# Altium project NeptuneSenseOutdoor.PrjPcb
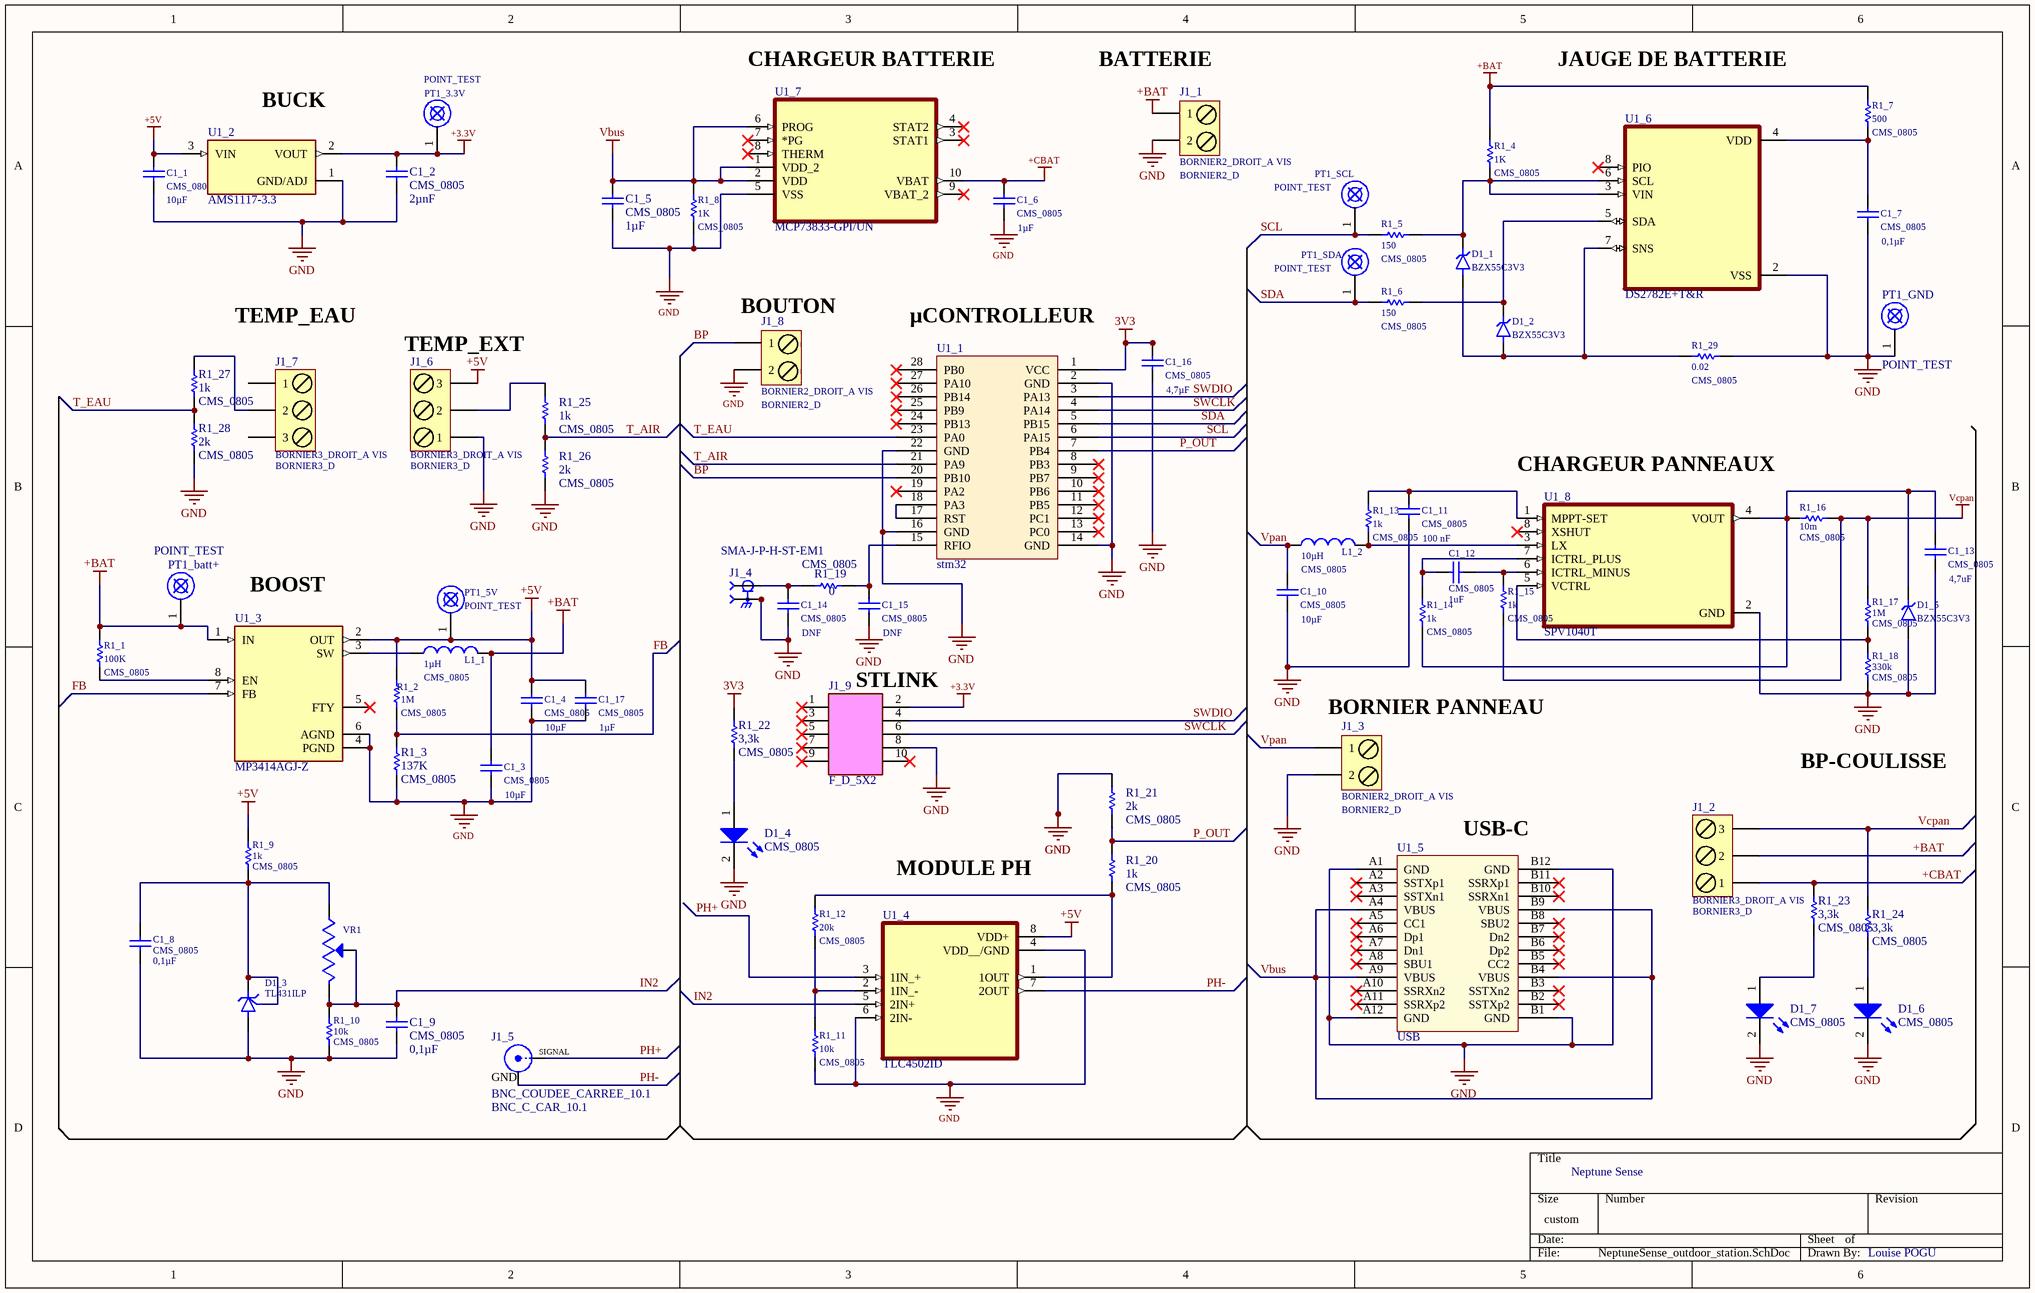
[diagram p0: NeptuneSense_outdoor_station.SchDoc]
1 sheet, 79 parts. Net scope: global (net labels, ports and power ports of the same name join across sheets).
Board file: NeptuneSense_outdoor_station.PcbDoc

## Sheet NeptuneSense_outdoor_station.SchDoc
size 381 x 241 mm; SheetNumber: 1; SheetTotal: 1

### Parts
C1_1  value 10µF  [CONDENSATEUR_CMS_0805]  (hidden comment: CMS_0805)
C1_2  value 2µnF  [CONDENSATEUR_CMS_0805]  (hidden comment: CMS_0805)
C1_3  value 10µF  [CONDENSATEUR_CMS_0805]  (hidden comment: CMS_0805)
C1_4  value 10µF  [CONDENSATEUR_CMS_0805]  (hidden comment: CMS_0805)
C1_5  value 1µF  [CONDENSATEUR_CMS_0805]  (hidden comment: CMS_0805)
C1_6  value 1µF  [CONDENSATEUR_CMS_0805]  (hidden comment: CMS_0805)
C1_7  value 0,1µF  [CONDENSATEUR_CMS_0805]  (hidden comment: CMS_0805)
C1_8  value 0,1µF  [CONDENSATEUR_CMS_0805]  (hidden comment: CMS_0805)
C1_9  value 0,1µF  [CONDENSATEUR_CMS_0805]  (hidden comment: CMS_0805)
C1_10  value 10µF  [CONDENSATEUR_CMS_0805]  (hidden comment: CMS_0805)
C1_11  value 100 nF  [CONDENSATEUR_CMS_0805]  (hidden comment: CMS_0805)
C1_12  value 1uF  [CONDENSATEUR_CMS_0805]  (hidden comment: CMS_0805)
C1_13  value 4,7uF  [CONDENSATEUR_CMS_0805]  (hidden comment: CMS_0805)
C1_14  value DNF  [CONDENSATEUR_CMS_0805]  (hidden comment: CMS_0805)  (net tie, no BOM)
C1_15  value DNF  [CONDENSATEUR_CMS_0805]  (hidden comment: CMS_0805)
C1_16  value 4,7µF  [CONDENSATEUR_CMS_0805]  (hidden comment: CMS_0805)
C1_17  value 1µF  [CONDENSATEUR_CMS_0805]  (hidden comment: CMS_0805)
D1_1  BZX55C3V3  [DIOAD928W47L399D179]
D1_2  BZX55C3V3  [DIOAD928W47L399D179]
D1_3  TL431ILP  [TO92127P520H660-3]
D1_4  Type: CMS_0805  [LED_CMS_0805]  (hidden comment: LED_CMS_0805)
D1_5  BZX55C3V3  [DIOAD928W47L399D179]
D1_6  Type: CMS_0805  [LED_CMS_0805]  (hidden comment: LED_CMS_0805)
D1_7  Type: CMS_0805  [LED_CMS_0805]  (hidden comment: LED_CMS_0805)
J1_1  BORNIER2_DROIT_A VIS  Type: BORNIER2_D  [BORNIER2_A_VIS]
J1_2  BORNIER3_DROIT_A VIS  Type: BORNIER3_D  [BORNIER3_A_VIS]
J1_3  BORNIER2_DROIT_A VIS  Type: BORNIER2_D  [BORNIER2_A_VIS]
J1_4  SMA-J-P-H-ST-EM1  [SAMTEC_SMA-J-P-H-ST-EM1]
J1_5  BNC_COUDEE_CARREE_10.1  [BNC_C_CAR_10.1]
J1_6  BORNIER3_DROIT_A VIS  Type: BORNIER3_D  [BORNIER3_A_VIS]
J1_7  BORNIER3_DROIT_A VIS  Type: BORNIER3_D  [BORNIER3_A_VIS]
J1_8  BORNIER2_DROIT_A VIS  Type: BORNIER2_D  [BORNIER2_A_VIS]
J1_9  Type: F_D_5X2  [BARRETTE_5X2_F_D]  (hidden comment: BARRETTE_5 CONTACTS_2 RANGEES_FEMELLE_DROITE)
L1_1  value 1µH  Type: CMS_0805  [INDUCTANCE_CMS_0805]  (hidden comment: INDUCTANCE_CMS_0805)
L1_2  value 10µH  Type: CMS_0805  [INDUCTANCE_CMS_0805]  (hidden comment: INDUCTANCE_CMS_0805)
PT1_3.3V  POINT_TEST  [POINT_TEST]
PT1_5V  POINT_TEST  [POINT_TEST]
PT1_batt+  POINT_TEST  [POINT_TEST]
PT1_GND  POINT_TEST  [POINT_TEST]
PT1_SCL  POINT_TEST  [POINT_TEST]
PT1_SDA  POINT_TEST  [POINT_TEST]
R1_1  value 100K  Type: CMS_0805  [RESISTANCE_CMS_0805]  (hidden comment: RESISTANCE_CMS_0805)
R1_2  value 1M  Type: CMS_0805  [RESISTANCE_CMS_0805]  (hidden comment: RESISTANCE_CMS_0805)
R1_3  value 137K  Type: CMS_0805  [RESISTANCE_CMS_0805]  (hidden comment: RESISTANCE_CMS_0805)
R1_4  value 1K  Type: CMS_0805  [RESISTANCE_CMS_0805]  (hidden comment: RESISTANCE_CMS_0805)
R1_5  value 150  Type: CMS_0805  [RESISTANCE_CMS_0805]  (hidden comment: RESISTANCE_CMS_0805)
R1_6  value 150  Type: CMS_0805  [RESISTANCE_CMS_0805]  (hidden comment: RESISTANCE_CMS_0805)
R1_7  value 500  Type: CMS_0805  [RESISTANCE_CMS_0805]  (hidden comment: RESISTANCE_CMS_0805)
R1_8  value 1K  Type: CMS_0805  [RESISTANCE_CMS_0805]  (hidden comment: RESISTANCE_CMS_0805)
R1_9  value 1k  Type: CMS_0805  [RESISTANCE_CMS_0805]  (hidden comment: RESISTANCE_CMS_0805)
R1_10  value 10k  Type: CMS_0805  [RESISTANCE_CMS_0805]  (hidden comment: RESISTANCE_CMS_0805)
R1_11  value 10k  Type: CMS_0805  [RESISTANCE_CMS_0805]  (hidden comment: RESISTANCE_CMS_0805)
R1_12  value 20k  Type: CMS_0805  [RESISTANCE_CMS_0805]  (hidden comment: RESISTANCE_CMS_0805)
R1_13  value 1k  Type: CMS_0805  [RESISTANCE_CMS_0805]  (hidden comment: RESISTANCE_CMS_0805)
R1_14  value 1k  Type: CMS_0805  [RESISTANCE_CMS_0805]  (hidden comment: RESISTANCE_CMS_0805)
R1_15  value 1k  Type: CMS_0805  [RESISTANCE_CMS_0805]  (hidden comment: RESISTANCE_CMS_0805)
R1_16  value 10m  Type: CMS_0805  [RESISTANCE_CMS_0805]  (hidden comment: RESISTANCE_CMS_0805)
R1_17  value 1M  Type: CMS_0805  [RESISTANCE_CMS_0805]  (hidden comment: RESISTANCE_CMS_0805)
R1_18  value 330k  Type: CMS_0805  [RESISTANCE_CMS_0805]  (hidden comment: RESISTANCE_CMS_0805)
R1_19  value 0  Type: CMS_0805  [RESISTANCE_CMS_0805]  (hidden comment: RESISTANCE_CMS_0805)
R1_20  value 1k  Type: CMS_0805  [RESISTANCE_CMS_0805]  (hidden comment: RESISTANCE_CMS_0805)
R1_21  value 2k  Type: CMS_0805  [RESISTANCE_CMS_0805]  (hidden comment: RESISTANCE_CMS_0805)
R1_22  value 3,3k  Type: CMS_0805  [RESISTANCE_CMS_0805]  (hidden comment: RESISTANCE_CMS_0805)
R1_23  value 3,3k  Type: CMS_0805  [RESISTANCE_CMS_0805]  (hidden comment: RESISTANCE_CMS_0805)
R1_24  value 3,3k  Type: CMS_0805  [RESISTANCE_CMS_0805]  (hidden comment: RESISTANCE_CMS_0805)
R1_25  value 1k  Type: CMS_0805  [RESISTANCE_CMS_0805]  (hidden comment: RESISTANCE_CMS_0805)
R1_26  value 2k  Type: CMS_0805  [RESISTANCE_CMS_0805]  (hidden comment: RESISTANCE_CMS_0805)
R1_27  value 1k  Type: CMS_0805  [RESISTANCE_CMS_0805]  (hidden comment: RESISTANCE_CMS_0805)
R1_28  value 2k  Type: CMS_0805  [RESISTANCE_CMS_0805]  (hidden comment: RESISTANCE_CMS_0805)
R1_29  value 0.02  Type: CMS_0805  [RESISTANCE_CMS_0805]  (hidden comment: RESISTANCE_CMS_0805)
U1_1  stm32  [QFN127P600-8N]
U1_2  AMS1117-3.3  [SOT229P700X180-4N]
U1_3  MP3414AGJ-Z  [SOT65P280X100-8N]
U1_4  TLC4502ID  [SOIC127P599X175-8N]
U1_5  USB  [USB]
U1_6  DS2782E+T&R  [SOP65P640X110-8N]
U1_7  MCP73833-GPI/UN  [SOP50P490X110-10N]
U1_8  SPV1040T  [SOP65P640X120-8N]
VR1  3296W1103LF  [TRIM_3296W1103LF]  (value not drawn)

### Nets
3V3: C1_16.2 R1_22.1 U1_1.1(VCC)
+3.3V: C1_2.2 J1_9.2 PT1_3.3V.1 U1_2.2(VOUT)
+5V: C1_1.1 C1_4.2 C1_17.2 J1_6.3 PT1_5V.1 R1_2.2 R1_9.1 U1_2.3(VIN) U1_3.2(OUT) U1_4.8(VDD+)
+BAT: C1_3.2 J1_1.1 J1_2.2 L1_1.2 PT1_batt+.1 R1_1.2 R1_4.2 R1_7.2 U1_3.1(IN)
+CBAT: C1_6.2 J1_2.1 R1_23.1 U1_7.10(VBAT)
GND: C1_1.2 C1_2.1 C1_3.1 C1_4.1 C1_5.1 C1_6.1 C1_7.1 C1_8.1 C1_9.1 C1_10.1 C1_11.1 C1_13.1 C1_14.1 C1_15.1 C1_16.1 C1_17.1 D1_3.2(A) D1_4.2 D1_5.A D1_6.2 D1_7.2 J1_1.2 J1_3.2 J1_4.2_1 J1_4.2_2 J1_4.3_1 J1_4.3_2 J1_6.1 J1_8.2 J1_9.8 PT1_GND.1 R1_3.1 R1_8.1 R1_10.2 R1_11.2 R1_18.1 R1_21.1 R1_26.2 R1_28.2 R1_29.1 U1_1.2(GND) U1_1.14(GND) U1_1.16(GND) U1_1.22(GND) U1_2.1(GND/ADJ) U1_3.4(PGND) U1_3.6(AGND) U1_4.4(VDD__/GND) U1_4.6(2IN-) U1_5.A1(GND) U1_5.A12(GND) U1_5.B1(GND) U1_5.B12(GND) U1_6.2(VSS) U1_7.5(VSS) U1_8.2(GND)
Vbus: C1_5.2 R1_8.2 U1_5.A4(VBUS) U1_5.A9(VBUS) U1_5.B4(VBUS) U1_5.B9(VBUS) U1_7.1(VDD_2) U1_7.2(VDD) U1_7.6(PROG)
Vcpan: J1_2.3 R1_15.2 R1_16.2 R1_17.2 R1_24.1
BP: J1_8.1 U1_1.20(PB10)
FB: R1_2.1 R1_3.2 U1_3.7(FB)
IN2: C1_9.2 R1_10.1 U1_4.5(2IN+) VR1.2(WIPER) VR1.3(CW)
P_OUT: R1_20.1 R1_21.2 U1_1.7(PB4)
PH+: J1_5.1(X) U1_4.3(1IN_+)
PH-: J1_5.2(Y) U1_4.7(2OUT)
SCL: PT1_SCL.1 R1_5.2 U1_1.6(PA15)
SDA: PT1_SDA.1 R1_6.2 U1_1.5(PB15)
SWCLK: J1_9.6 U1_1.4(PA14)
SWDIO: J1_9.4 U1_1.3(PA13)
T_AIR: R1_25.2 R1_26.1 U1_1.21(PA9)
T_EAU: R1_27.2 R1_28.1 U1_1.23(PA0)
Vpan: C1_10.2 J1_3.1 L1_2.1
NetC1_7_2: C1_7.2 R1_7.1 U1_6.4(VDD)
NetC1_8_2: C1_8.2 D1_3.1(REF) D1_3.3(C) R1_9.2 VR1.1(CCW)
NetC1_11_2: C1_11.2 R1_13.1 U1_8.1(MPPT-SET)
NetC1_12_1: C1_12.1 R1_15.1 U1_8.6(ICTRL_MINUS)
NetC1_12_2: C1_12.2 R1_14.1 U1_8.7(ICTRL_PLUS)
NetC1_13_2: C1_13.2 D1_5.C(K) R1_14.2 R1_16.1 U1_8.4(VOUT)
NetC1_14_2: C1_14.2 J1_4.1 R1_19.2
NetC1_15_2: C1_15.2 R1_19.1 U1_1.15(RFIO)
NetD1_1_A: D1_1.A D1_2.A R1_29.2 U1_6.7(SNS)
NetD1_1_C: D1_1.C(K) R1_4.1 R1_5.1 U1_6.3(VIN) U1_6.6(SCL)
NetD1_2_C: D1_2.C(K) R1_6.1 U1_6.5(SDA)
NetD1_4_1: D1_4.1 R1_22.2
NetD1_6_1: D1_6.1 R1_24.2
NetD1_7_1: D1_7.1 R1_23.2
NetJ1_6_2: J1_6.2 R1_25.1
NetJ1_7_2: J1_7.2 R1_27.1
NetL1_1_1: L1_1.1 U1_3.3(SW)
NetL1_2_2: L1_2.2 R1_13.2 U1_8.3(LX)
NetR1_1_1: R1_1.1 U1_3.8(EN)
NetR1_11_1: R1_11.1 R1_12.2 U1_4.2(1IN_-)
NetR1_12_1: R1_12.1 R1_20.2 U1_4.1(1OUT)
NetR1_17_1: R1_17.1 R1_18.2 U1_8.5(VCTRL)
NetU1_1_17: U1_1.17(RST) U1_1.18(PA3)

Not connected (* = marked no-connect by the designer): J1_7 1 3; J1_9 1* 3* 5* 7* 9* 10*; U1_1 8(PB3)* 9(PB7)* 10(PB6)* 11(PB5)* 12(PC1)* 13(PC0)* 19(PA2)* 24(PB13)* 25(PB9)* 26(PB14)* 27(PA10)* 28(PB0)*; U1_3 5(FTY)*; U1_5 A2(SSTXp1)* A3(SSTXn1)* A5(CC1)* A6(Dp1)* A7(Dn1)* A8(SBU1)* A10(SSRXn2)* A11(SSRXp2)* B2(SSTXp2)* B3(SSTXn2)* B5(CC2)* B6(Dp2)* B7(Dn2)* B8(SBU2)* B10(SSRXn1)* B11(SSRXp1)*; U1_6 8(PIO)*; U1_7 3(STAT1)* 4(STAT2)* 7(*PG)* 8(THERM)* 9(VBAT_2)*; U1_8 8(XSHUT)*

### Notes on the sheet
- CHARGEUR BATTERIE
- (near J1_1) BATTERIE
- JAUGE DE BATTERIE
- (near U1_2) BUCK
- TEMP_EAU
- (near J1_6) TEMP_EXT
- (near J1_8) BOUTON
- (near U1_1) µCONTROLLEUR
- (near U1_8) CHARGEUR PANNEAUX
- (near U1_3) BOOST
- (near J1_9) STLINK
- (near J1_3) BORNIER PANNEAU
- BP-COULISSE
- (near U1_5) USB-C
- MODULE PH
- Neptune Sense
- Louise POGU
- (in symbol CMP-118-000188-1) SIGNAL; GND

### Library data of the parts
C1_1-C1_17 = CONDENSATEUR_CMS_CER_0805: CONDENSATEUR CMS CERAMIQUE 0805; Type: CMS_0805
D1_1 D1_2 D1_5 = CMP-177-000000-1: Zener Diode Single 3.3V 5% 85Ohm 500mW 2-Pin DO-35 T/R; MF: Taiwan Semiconductor; SnapEDA_Link: https://www.snapeda.com/parts/BZX55C3V3/Taiwan+Semiconductor/view-part/?ref=snap; MP: BZX55C3V3; Pin Count: 2; Package: DO-35-2 Taiwan Semiconductor; Check_prices: https://www.snapeda.com/parts/BZX55C3V3/Taiwan+Semiconductor/view-part/?ref=eda; Value: *; Source: BZX55C3V3.SchLib; Design Item ID: BZX55C3V3; Component Type: Standard
D1_3 = CMP-170-000000-1: Ic, Tl431ilp, Tl431, Tl431a, Tl4 31b, Tl432, Tl432a, Tl432b<Nv; Price: None; Source: TL431ILP.SchLib; Pin Count: 3; Package: None; MP: TL431ILP; Design Item ID: TL431ILP; Component Type: Standard; Value: *; Availability: Unavailable
D1_4 D1_6 D1_7 = LED_CMS_0805: LED CMS 0805
J1_1 J1_3 J1_8 = CMP-118-000038-1: BORNIER 2 PLOTS DROIT A VIS 5.08mm; Source: connecteurs.SchLib; Design Item ID: BORNIER2_DROIT_A VIS
J1_2 J1_6 J1_7 = CMP-118-000178-1: BORNIER 3 PLOTS DROIT A VIS 5.08mm; Source: connecteurs.SchLib; Design Item ID: BORNIER3_DROIT_A VIS
J1_4 = CMP-200-000000-1: SMA Connector Jack, Female Socket 50Ohm Board Edge, End Launch Solder; MF: Samtec; Source: SMA-J-P-H-ST-EM1.SchLib; Price: None; Pin Count: 5; Component Type: Standard; MP: SMA-J-P-H-ST-EM1; Design Item ID: SMA-J-P-H-ST-EM1; Package: None; Availability: Unavailable; Value: *
J1_5 = CMP-118-000188-1: EMBASE BNC COUDEE CARREE 50r - ESPACEMENT BROCHES GND=10.1; Type: BNC_C_CAR_10.1; Source: connecteurs.SchLib; Design Item ID: BNC_COUDEE_CARREE_10.1
J1_9 = BARRETTE_5 CONTACTS_2 RANGEES_FEMELLE_DROITE: BARRETTE 5 CONTACTS 2 RANGEES FEMELLE DROITE
L1_1 L1_2 = INDUCTANCE_CMS_0805: INDUCTANCE CMS 0805
PT1_3.3V PT1_5V PT1_batt+ PT1_GND PT1_SCL PT1_SDA = CMP-118-000011-1: POINT TEST; Source: connecteurs.SchLib; Design Item ID: POINT_TEST
R1_1-R1_29 = RESISTANCE_CMS_0805: RESISTANCE CMS 0805
U1_2 = CMP-154-000000-1: LDO Voltage Regulators 800MA LDO LINEAR REG; MF: ams AG; Design Item ID: AMS1117-3.3; Price: None; Source: AMS1117-3.3.SchLib; MP: AMS1117-3.3; Package: SOT-223 Seeed Technology; Value: *; Component Type: Standard; SnapEDA_Link: https://www.snapeda.com/parts/AMS1117-3.3/AMS+AG/view-part/?ref=snap; Pin Count: 3; Purchase-URL: https://pricing.snapeda.com/search/part/AMS1117-3.3/?ref=eda; Availability: In Stock
U1_3 = CMP-156-000001-1: Boost Switching Regulator IC Positive Adjustable 2V 1 Output 3A SOT-23-8; MF: Monolithic Power; Price: None; Design Item ID: MP3414AGJ-Z; Component Type: Standard; Pin Count: 8; Availability: Unavailable; SnapEDA_Link: https://www.snapeda.com/parts/MP3414AGJ-Z/Monolithic%20Power%20Systems%20Inc./view-part/1062936/?ref=snap; Value: *; Package: TSOT-23 MPS; Source: SnapEDAsch.SchLib; MP: MP3414AGJ-Z
U1_4 = CMP-172-000000-1: Advanced LinEPIC Self-Calibrating Precision Dual Operational Amplifier 8-SOIC -40 to 125; MF: Texas Instruments; Price: None; Availability: Warning; Check_prices: https://www.snapeda.com/parts/TLC4502ID/Texas%20Instruments/view-part/1176387/?ref=eda; Source: TLC4502ID.SchLib; MP: TLC4502ID; Value: *; Design Item ID: TLC4502ID; SnapEDA_Link: https://www.snapeda.com/parts/TLC4502ID/Texas%20Instruments/view-part/1176387/?ref=snap; Pin Count: 8; Purchase-URL: https://pricing.snapeda.com/search/part/TLC4502ID/?ref=eda; Package: SOIC-8 Texas Instruments; Component Type: Standard
U1_6 = CMP-168-000000-1: Power Management IC Development Tools DS2782 EVAL KIT; MF: Maxim Integrated; Design Item ID: DS2782E+T&R; Purchase-URL: https://pricing.snapeda.com/search/part/DS2782E+T/?ref=eda; MP: DS2782E+T; Availability: In Stock; Check_prices: https://www.snapeda.com/parts/DS2782E+T/Maxim+Integrated/view-part/?ref=eda; SnapEDA_Link: https://www.snapeda.com/parts/DS2782E+T/Maxim+Integrated/view-part/?ref=snap; Value: *; Source: DS2782E+T&R.SchLib; Component Type: Standard; Package: TSSOP-8 Maxim Integrated; Price: None; Pin Count: 7
U1_7 = CMP-188-000000-1: Charger IC Lithium Ion/Polymer 10-MSOP; MF: Microchip; Component Type: Standard; MP: MCP73833-GPI/UN; Source: SnapEDAsch.SchLib; Value: *; Design Item ID: MCP73833-GPI/UN; SnapEDA_Link: https://www.snapeda.com/parts/MCP73833-GPI/UN/Microchip/view-part/526145/?ref=snap; Package: MSOP-10 Microchip; Pin Count: 10; Digi-Key_Purchase_URL: https://www.digikey.rs/product-detail/en/microchip-technology/MCP73833-GPI-UN/MCP73833-GPI-UN-ND/1626620?utm_source=snapeda&utm_medium=aggregator&utm_campaign=symbol; Digi-Key_Part_Number: MCP73833-GPI/UN-ND
U1_8 = CMP-190-000000-1: IC BATTERY CHARGER SOLAR 8TSSOP; MF: STMicroelectronics; MP: SPV1040T; Pin Count: 8; Design Item ID: SPV1040T; Package: TSSOP-8 STMicroelectronics; SnapEDA_Link: https://www.snapeda.com/parts/SPV1040T/STMicroelectronics/view-part/480076/?ref=snap; Value: *; Component Type: Standard; Source: SnapEDAsch.SchLib; Price: None; Availability: Unavailable
VR1 = CMP-179-000000-1: Trimmer, Potentiometer 10kohm 25turn Thd; MF: Bourns; Design Item ID: 3296W1103LF; Availability: Unavailable; Check_prices: https://www.snapeda.com/parts/3296W1103LF/Bourns/view-part/2487625/?ref=eda; Pin Count: 3; Source: 3296W1103LF.SchLib; Price: None; SnapEDA_Link: https://www.snapeda.com/parts/3296W1103LF/Bourns/view-part/2487625/?ref=snap; Component Type: Standard; MP: 3296W1103LF; Package: None